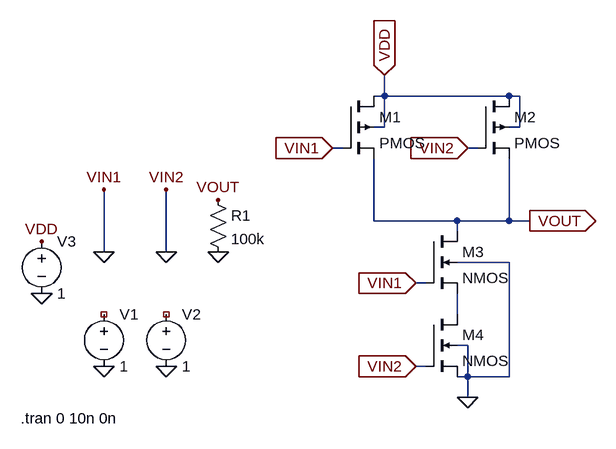
[diagram p0: schematic nand-debug.asc]
nand-debug.asc, the LTspice schematic file:
Version 4
SHEET 1 880 884
WIRE 128 112 128 80
WIRE 128 112 112 112
WIRE 320 112 128 112
WIRE 336 112 320 112
WIRE 128 160 128 112
WIRE 128 160 112 160
WIRE 336 160 336 112
WIRE 336 160 320 160
WIRE 64 192 48 192
WIRE 272 192 256 192
WIRE 112 304 112 208
WIRE 240 304 112 304
WIRE 320 304 320 208
WIRE 320 304 240 304
WIRE 352 304 320 304
WIRE 240 320 240 304
WIRE -304 352 -304 256
WIRE -208 352 -208 256
WIRE 320 368 240 368
WIRE 192 400 176 400
WIRE 240 448 240 416
WIRE 256 496 240 496
WIRE 192 528 176 528
WIRE 256 544 256 496
WIRE 256 544 240 544
WIRE 320 544 320 368
WIRE 320 544 256 544
WIRE 256 576 256 544
FLAG 48 192 VIN1
IOPIN 48 192 In
FLAG 256 192 VIN2
IOPIN 256 192 In
FLAG 256 576 0
FLAG 176 400 VIN1
IOPIN 176 400 In
FLAG 176 528 VIN2
IOPIN 176 528 In
FLAG 128 80 VDD
IOPIN 128 80 In
FLAG 352 304 VOUT
IOPIN 352 304 Out
FLAG -304 528 0
FLAG -208 528 0
FLAG -304 256 VIN1
FLAG -208 256 VIN2
FLAG -400 416 0
FLAG -400 336 VDD
FLAG -304 352 0
FLAG -208 352 0
FLAG -128 352 0
FLAG -128 272 VOUT
SYMBOL pmos4 64 112 R0
SYMATTR InstName M1
SYMATTR Value2 l=90n w=400n
SYMBOL pmos4 272 112 R0
SYMATTR InstName M2
SYMATTR Value2 l=90 w=400
SYMBOL nmos4 192 320 R0
SYMATTR InstName M3
SYMATTR Value2 l=90 w=200
SYMBOL nmos4 192 448 R0
SYMATTR InstName M4
SYMATTR Value2 l=90n w=200n
SYMBOL voltage -304 432 R0
WINDOW 123 0 0 Left 0
WINDOW 39 0 0 Left 0
SYMATTR InstName V1
SYMATTR Value 1
SYMBOL voltage -208 432 R0
WINDOW 123 0 0 Left 0
WINDOW 39 0 0 Left 0
SYMATTR InstName V2
SYMATTR Value 1
SYMBOL voltage -400 320 R0
WINDOW 123 0 0 Left 0
WINDOW 39 0 0 Left 0
SYMATTR InstName V3
SYMATTR Value 1
SYMBOL res -144 256 R0
SYMATTR InstName R1
SYMATTR Value 100k
TEXT -432 608 Left 2 !.tran 0 10n 0n

The netlist it stands for:
* nand-debug.asc
M1 VDD 0 VOUT VDD PMOS l=90n w=400n
M2 VDD 0 VOUT VDD PMOS l=90 w=400
M3 VOUT 0 N001 0 NMOS l=90 w=200
M4 N001 0 0 0 NMOS l=90n w=200n
V1 NC_01 0 1
V2 NC_02 0 1
V3 VDD 0 1
R1 VOUT 0 100k
.model NMOS NMOS
.model PMOS PMOS
.lib standard.mos
.tran 0 10n 0n
.backanno
.end